# Altium schematic sheet QSPI.SchDoc: MIŠKO 3.0
size A4; Date: 19.9.2021; Author: AMADEJ PAPEŽ; SheetNumber: 12; SheetTotal: 13; Version: V1.1; SheetTitle: QSPI; Time: 1
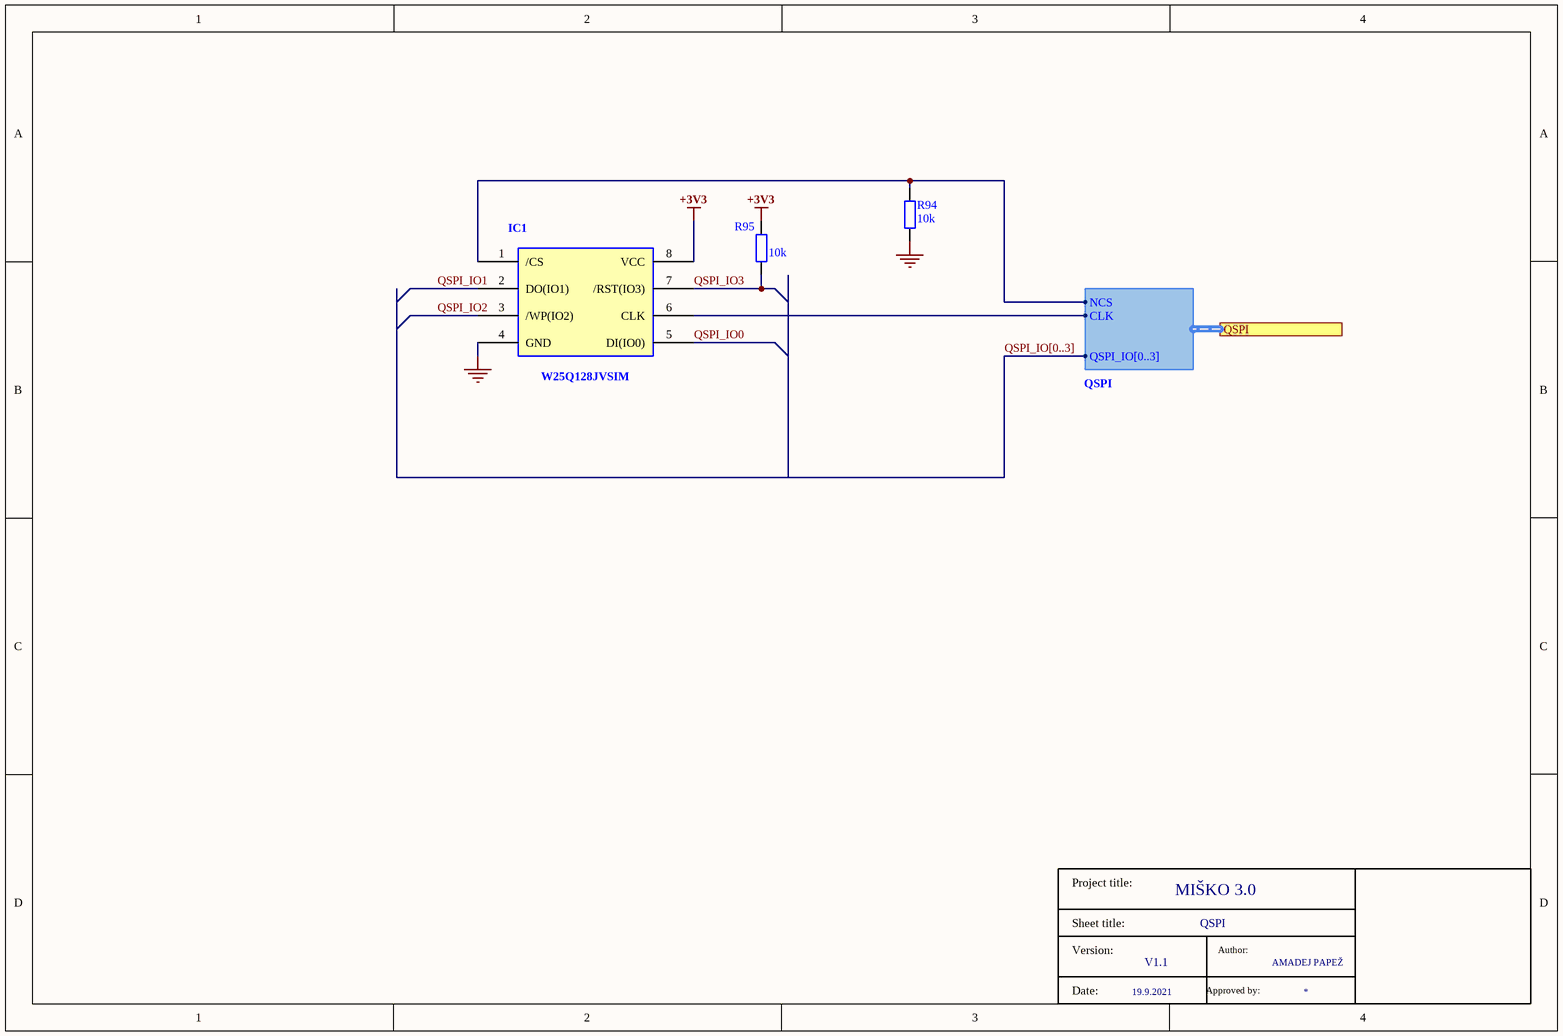
[diagram p0: QSPI.SchDoc]

## Parts
IC1  W25Q128JVSIM  [W25Q128JVSIM]
R94  value 10k  [R1608_0603I_L]
R95  value 10k  [R1608_0603I_L]
T12  (no value)

## Ports
QSPI (harness QSPI)

## Harnesses
QSPI: NCS, CLK, QSPI_IO[0..3]

## Nets
+3V3: IC1.8(VCC) R95.1
GND: IC1.4(GND) R94.2
QSPI_IO0: IC1.5(DI(IO0))
QSPI_IO1: IC1.2(DO(IO1))
QSPI_IO2: IC1.3(/WP(IO2))
QSPI_IO3: IC1.7(/RST(IO3)) R95.2
NetIC1_1: IC1.1(/CS) R94.1 ; port QSPI.NCS
NetIC1_6: IC1.6(CLK) ; port QSPI.CLK

## Buses and harness runs
bus QSPI_IO[0..3]

## Notes on the sheet
- (in symbol Title block) Project title:; Sheet title:; Version:; Author:; Date:; Approved by:

## Library data of the parts
IC1 = W25Q128JVSIM: FLASH - NOR Memory IC 128Mb (16M x 8) SPI - Quad I/O, QPI, DTR 133MHz 8-SOIC
R94 R95 = R: Code: LC5-10K
T12 = Title block